# Altium schematic sheet bq78pl116.SchDoc
size A4; DocumentNumber: 2; SheetNumber: 2; SheetTotal: 4
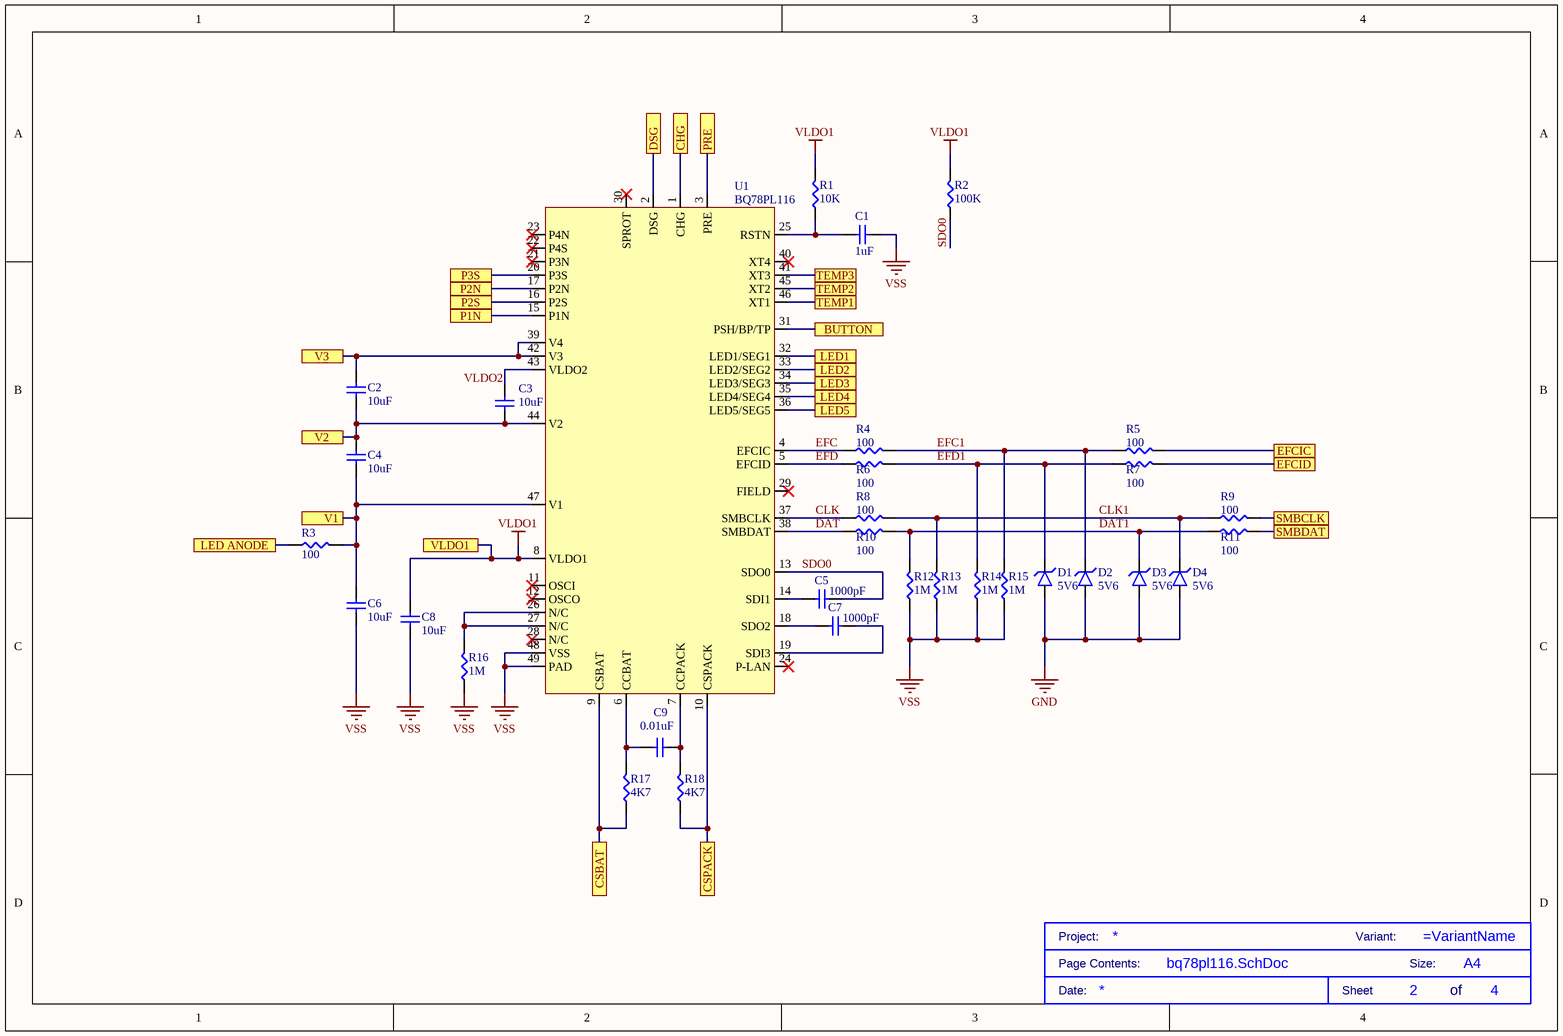
[diagram p0: bq78pl116.SchDoc]

## Parts
*  Size: A4  (hidden comment: TITLE BLOCK)  (graphical)
C1  1uF  [C0805]
C2  10uF  [C0805]
C3  10uF  [C0805]
C4  10uF  [C0805]
C5  1000pF  [C0805]
C6  10uF  [C0805]
C7  1000pF  [C0805]
C8  10uF  [C0805]
C9  0.01uF  [C0805]
D1  5V6  [MiniMELF]
D2  5V6  [MiniMELF]
D3  5V6  [MiniMELF]
D4  5V6  [MiniMELF]
R1  10K  [R0805]
R2  100K  [R0805]
R3  100  [R0805]
R4  100  [R0805]
R5  100  [R0805]
R6  100  [R0805]
R7  100  [R0805]
R8  100  [R0805]
R9  100  [R0805]
R10  100  [R0805]
R11  100  [R0805]
R12  1M  [R0805]
R13  1M  [R0805]
R14  1M  [R0805]
R15  1M  [R0805]
R16  1M  [R0805]
R17  4K7  [R0805]
R18  4K7  [R0805]
U1  BQ78PL116  [VQFN-48]

## Ports
BUTTON, CHG, CSBAT, CSPACK, DSG, EFCIC, EFCID, LED1, LED2, LED3, LED4, LED5, LED ANODE, P1N, P2N, P2S, P3S, PRE, SMBCLK, SMBDAT, TEMP1, TEMP2, TEMP3, V1, V2, V3, VLDO1

## Nets
GND: D1.1(A) D2.1(A) D3.1(A) D4.1(A)
VLDO1: C8.1 R1.2 R2.2 U1.8(VLDO1) ; port VLDO1
VSS: C1.2 C6.2 C8.2 R12.1 R13.1 R14.1 R15.1 R16.1 U1.48(VSS) U1.49(PAD)
BUTTON: U1.31(PSH/BP/TP) ; port BUTTON
CHG: U1.1(CHG) ; port CHG
CLK: R8.1 U1.37(SMBCLK)
CLK1: D4.2(K) R8.2 R9.1 R13.2
CSBAT: R17.1 U1.9(CSBAT) ; port CSBAT
CSPACK: R18.1 U1.10(CSPACK) ; port CSPACK
DAT: R10.1 U1.38(SMBDAT)
DAT1: D3.2(K) R10.2 R11.1 R12.2
DSG: U1.2(DSG) ; port DSG
EFC: R4.1 U1.4(EFCIC)
EFC1: D2.2(K) R4.2 R5.1 R15.2
EFCIC: R5.2 ; port EFCIC
EFCID: R7.2 ; port EFCID
EFD: R6.1 U1.5(EFCID)
EFD1: D1.2(K) R6.2 R7.1 R14.2
LED1: U1.32(LED1/SEG1) ; port LED1
LED2: U1.33(LED2/SEG2) ; port LED2
LED3: U1.34(LED3/SEG3) ; port LED3
LED4: U1.35(LED4/SEG4) ; port LED4
LED5: U1.36(LED5/SEG5) ; port LED5
LED ANODE: R3.2 ; port LED ANODE
P1N: U1.15(P1N) ; port P1N
P2N: U1.17(P2N) ; port P2N
P2S: U1.16(P2S) ; port P2S
P3S: U1.20(P3S) ; port P3S
PRE: U1.3(PRE) ; port PRE
SDO0: C5.2 R2.1 U1.13(SDO0)
SMBCLK: R9.2 ; port SMBCLK
SMBDAT: R11.2 ; port SMBDAT
TEMP1: U1.46(XT1) ; port TEMP1
TEMP2: U1.45(XT2) ; port TEMP2
TEMP3: U1.41(XT3) ; port TEMP3
V1: C4.2 C6.1 R3.1 U1.47(V1) ; port V1
V2: C2.2 C3.2 C4.1 U1.44(V2) ; port V2
V3: C2.1 U1.39(V4) U1.42(V3) ; port V3
VLDO2: C3.1 U1.43(VLDO2)
NetC1_1: C1.1 R1.1 U1.25(RSTN)
NetC5_1: C5.1 U1.14(SDI1)
NetC7_1: C7.1 U1.18(SDO2)
NetC7_2: C7.2 U1.19(SDI3)
NetC9_1: C9.1 R17.2 U1.6(CCBAT)
NetC9_2: C9.2 R18.2 U1.7(CCPACK)
NetR16_2: R16.2 U1.26(N/C) U1.27(N/C)

Not connected (* = marked no-connect by the designer): U1 11(OSCI)* 12(OSCO)* 21(P3N)* 22(P4S)* 23(P4N)* 24(P-LAN)* 28(N/C)* 29(FIELD)* 30(SPROT)* 40(XT4)*

## Notes on the sheet
- (in symbol TITLE BLOCK) Project:; Variant:; Page Contents:; Size:; Date:; Sheet; of

## Library data of the parts
C1 = CAP 0805 1uF: 0805 C 1uF Ceramic Multilayer Capacitor; 50 V; +125degC; X7R Dielectric; +/-10%; Manufacturer: KEMET; Manufacturer Part Number: C0805C105K5RACTU; Tolerance: 10%; Voltage Rating: 50V; Supplier 1: Arrow Electronics; RoHS: Yes; Category: Ceramic Capacitors; Stock 1: 317103; Pricing 1: 2500=0,25080, 10000=0,22150 (USD); Mount: Surface Mount,PCB; Case/Package: 0805; Case Code (Metric): 2012; Case Code (Imperial): 0805; Contact Plating: Tin,Matte; Dielectric Material: Ceramic; Min Operating Temperature: -55°C; Max Operating Temperature: 125°C; Packaging: Tape and Reel; Capacitance: 1uF; Voltage Rating (DC): 50V; Package Quantity: 1; Dielectric: X7R; Termination: SMD/SMT; Voltage: 50V; Series: C; Construction: Flat; Length: 2mm; Width: 0.049inch; Height: 1.25mm; Thickness: 0.055inch; Depth: 1.25mm; REACH SVHC: No SVHC; RoHS Compliant: Yes; ComponentLink1URL: https://datasheet.ciiva.com/7842/1732744-7842192.pdf?src-supplier=Element14; ComponentLink1Description: https://datasheet.ciiva.com/7842/1732744-7842192.pdf?src-supplier=Element14; ComponentLink2URL: https://datasheet.ciiva.com/5408/kem-c1002-x7r-smd-5408569.pdf?src-supplier=Mouser; ComponentLink2Description: https://datasheet.ciiva.com/5408/kem-c1002-x7r-smd-5408569.pdf?src-supplier=Mouser; ComponentLink3URL: https://datasheet.ciiva.com/22700/1851736-22700523.pdf?src-supplier=Element14; ComponentLink3Description: https://datasheet.ciiva.com/22700/1851736-22700523.pdf?src-supplier=Element14; Supplier Part Number 1: C0805C105K5RACTU
C2-C4 C6 C8 = CAP 0805 10uF: Cap Ceramic 10uF 10V X5R 10% SMD 0805 85C Plastic T/R; Manufacturer: KEMET; Manufacturer Part Number: C0805L106K8PACTU; Supplier 1: Mouser; RoHS: Yes; Category: Ceramic Capacitors; Stock 1: 15642; Pricing 1: 1=0,73000, 10=0,54000, 50=0,54000, 100=0,37000, 1000=0,24700, 10000=0,21500 (USD); Mount: Surface Mount; Case/Package: 0805; Case Code (Metric): 2012; Case Code (Imperial): 0805; Min Operating Temperature: -55°C; Max Operating Temperature: 85°C; Package Quantity: 4000; Capacitance: 10uF; Voltage Rating: 10V; Tolerance: 10%; Packaging: Tape and Reel; Dielectric: X5R; Termination: SMD/SMT; Voltage Rating (DC): 10V; Series: C; Length: 0.079inch; Width: 0.049inch; Thickness: 0.037inch; Depth: 1.25mm; REACH SVHC: No SVHC; RoHS Compliant: Yes; ComponentLink1URL: https://datasheet.ciiva.com/23928/1751297-23928886.pdf?src-supplier=Newark; ComponentLink1Description: https://datasheet.ciiva.com/23928/1751297-23928886.pdf?src-supplier=Newark; ComponentLink2URL: https://datasheet.ciiva.com/232/mlcclowprofile-232272.pdf?src-supplier=Digi-Key; ComponentLink2Description: https://datasheet.ciiva.com/232/mlcclowprofile-232272.pdf?src-supplier=Digi-Key; ComponentLink3URL: https://datasheet.ciiva.com/193/mlcclowprofile-193796.pdf?src-supplier=Digi-Key; ComponentLink3Description: https://datasheet.ciiva.com/193/mlcclowprofile-193796.pdf?src-supplier=Digi-Key; ComponentLink4URL: https://datasheet.ciiva.com/232/mlcclowprofile-232271.pdf?src-supplier=Digi-Key; ComponentLink4Description: https://datasheet.ciiva.com/232/mlcclowprofile-232271.pdf?src-supplier=Digi-Key; Supplier Part Number 1: 80-C0805L106K8P
C5 C7 = CAP 0805 1000pF: Cap Ceramic 0.001uF 50V X7R 10% SMD 0805 125C Plastic T/R; Manufacturer: KEMET; Manufacturer Part Number: C0805C102K5RACTU; Capacitance: 1nF; Supplier 1: Arrow Electronics; RoHS: Yes; Category: Ceramic Capacitors; Stock 1: 255800; Pricing 1: 4000=0,03830 (USD); Mount: Surface Mount,PCB; Case/Package: 0805; Number of Pins: 2; Dielectric Material: Ceramic; Case Code (Imperial): 0805; Case Code (Metric): 2012; Contact Plating: Tin,Matte; Min Operating Temperature: -55°C; Max Operating Temperature: 125°C; Tolerance: 10%; Packaging: Tape and Reel; Dielectric: X7R; Voltage Rating (DC): 50V; Voltage Rating: 50V; Series: SMD Comm X7R; Package Quantity: 4000; Termination: SMD/SMT; Construction: Flat; Voltage: 50V; Length: 2mm; Width: 1.25mm; Height: 0.78mm; Depth: 1.25mm; Lead Pitch: 0.75mm; Radiation Hardening: No; RoHS Compliant: Yes; REACH SVHC: No SVHC; ComponentLink1URL: https://datasheet.ciiva.com/7842/1918693-7842527.pdf?src-supplier=Element14; ComponentLink1Description: https://datasheet.ciiva.com/7842/1918693-7842527.pdf?src-supplier=Element14; ComponentLink2URL: https://datasheet.ciiva.com/18193/getdatasheetpartid-385640-18193338.pdf?src-supplier=Verical; ComponentLink2Description: https://datasheet.ciiva.com/18193/getdatasheetpartid-385640-18193338.pdf?src-supplier=Verical; ComponentLink3URL: https://datasheet.ciiva.com/39122/docfinderpartnumberc0402c102k5ractu-39122922.pdf?src-supplier=Onlinecomponents.com; ComponentLink3Description: https://datasheet.ciiva.com/39122/docfinderpartnumberc0402c102k5ractu-39122922.pdf?src-supplier=Onlinecomponents.com; Supplier Part Number 1: C0805C102K5RACTU
C9 = CAP 0805 0.01uF: Cap Ceramic 0.01uF 16V X7R 10% SMD 0805 125°C Paper T/R; Manufacturer: KEMET; Manufacturer Part Number: C0805C103K4RACTU; Capacitance: 10nF; Supplier 1: Arrow Electronics; RoHS: Yes; Category: Ceramic Capacitors; Stock 1: 24000; Pricing 1: 4000=0,07000, 8000=0,06640, 12000=0,06580, 20000=0,06310, 24000=0,05650, 100000=0,04830 (USD); Mount: Surface Mount; Case/Package: 0805; Case Code (Metric): 2012; Case Code (Imperial): 0805; Dielectric Material: Ceramic; Min Operating Temperature: -55°C; Max Operating Temperature: 125°C; Package Quantity: 1; Voltage Rating: 16V; Tolerance: 10%; Packaging: Tape and Reel; Voltage Rating (DC): 16V; Dielectric: X7R; Termination: SMD/SMT; Length: 2mm; Width: 0.049inch; Height: 0.78mm; Thickness: 0.035inch; Lead Pitch: 0.75mm; Depth: 1.25mm; Radiation Hardening: No; REACH SVHC: No SVHC; ComponentLink1URL: http://www.farnell.com/datasheets/2746090.pdf?src-supplier=Farnell; ComponentLink1Description: http://www.farnell.com/datasheets/2746090.pdf?src-supplier=Farnell; ComponentLink2URL: http://www.mouser.com/ds/2/212/KEM_C1002_X7R_SMD-1102033.pdf?src-supplier=Mouser; ComponentLink2Description: http://www.mouser.com/ds/2/212/KEM_C1002_X7R_SMD-1102033.pdf?src-supplier=Mouser; ComponentLink3URL: https://api.kemet.com/component-edge/download/datasheet/C0805C103K4RACTU.pdf?src-supplier=Digi-Key; ComponentLink3Description: https://api.kemet.com/component-edge/download/datasheet/C0805C103K4RACTU.pdf?src-supplier=Digi-Key; ComponentLink4URL: http://www.farnell.com/datasheets/1791936.pdf?src-supplier=Newark; ComponentLink4Description: http://www.farnell.com/datasheets/1791936.pdf?src-supplier=Newark; ComponentLink5URL: http://www.farnell.com/datasheets/2746090.pdf?src-supplier=Newark; ComponentLink5Description: http://www.farnell.com/datasheets/2746090.pdf?src-supplier=Newark; ComponentLink6URL: http://www.farnell.com/datasheets/2064983.pdf?src-supplier=Element14; ComponentLink6Description: http://www.farnell.com/datasheets/2064983.pdf?src-supplier=Element14; ComponentLink7URL: http://components.arrow.com/part/dataview/3450723S5469568N7429?src-supplier=Arrow+Electronics; ComponentLink7Description: http://components.arrow.com/part/dataview/3450723S5469568N7429?src-supplier=Arrow+Electronics; Supplier Part Number 1: C0805C103K4RACTU
D1-D4 = ZENER 5V6: Diode Zener Single 5.6V 7% 500mW Automotive 2-Pin Mini-MELF T/R; Manufacturer: Diotec; Manufacturer Part Number: ZMM5.6; Tolerance: 5%; Supplier 1: Arrow Electronics; RoHS: Yes; Category: Zener Diodes; Stock 1: 11; Pricing 1: 1=0,10930, 10=0,02530 (USD); Case/Package: SOD; Zener Voltage: 5.6V; Power Dissipation: 500mW; RoHS Compliant: Yes; ComponentLink1URL: https://datasheet.ciiva.com/26309/rvzmm1-zmm75-data-e-26309545.pdf?src-supplier=Distrelec; ComponentLink1Description: https://datasheet.ciiva.com/26309/rvzmm1-zmm75-data-e-26309545.pdf?src-supplier=Distrelec; Supplier Part Number 1: ZMM5.6
R1 = RES 0805 10K: Res Thick Film 0805 10K Ohm 5% 1/8W ±200ppm/°C Molded SMD Paper T/R; Manufacturer: Vishay Semiconductors; Manufacturer Part Number: CRCW080510K0JNEAC; Power Rating: 125mW; Resistance: 10kR; Supplier 1: Digi-Key; RoHS: Yes; Category: Resistors; Stock 1: 53351; Pricing 1: 1=0,10000, 10=0,03500, 100=0,01420, 1000=0,00636, 2500=0,00552 (USD); Mount: Surface Mount; Case/Package: SMD/SMT; Contact Plating: Tin; Min Operating Temperature: -55°C; Max Operating Temperature: 155°C; Resistor Type: Thick Film; Termination: Wraparound; Tolerance: 5%; Temperature Coefficient: 200ppm/°C; Length: 2mm; Lead Free: Lead Free; ComponentLink1URL: http://www.vishay.com/docs/20035/dcrcwe3.pdf?src-supplier=Avnet+Asia; ComponentLink1Description: http://www.vishay.com/docs/20035/dcrcwe3.pdf?src-supplier=Avnet+Asia; ComponentLink2URL: http://www.vishay.com/docs/28773/crcwce3.pdf?src-supplier=Digi-Key; ComponentLink2Description: http://www.vishay.com/docs/28773/crcwce3.pdf?src-supplier=Digi-Key; Supplier Part Number 1: 541-4163-1-ND
R2 = RES 0805 100K: RES SMD 100K OHM 5% 1/8W 0805; Manufacturer: Vishay; Manufacturer Part Number: CRCW0805100KJNEAC; Resistance: 100kR; Max Power Dissipation: 125mW; Temperature Coefficient: 200ppm/°C; Supplier 1: Digi-Key; RoHS: No; Category: Chip SMD Resistors; Stock 1: 93530; Pricing 1: 1=0,10000, 10=0,03500, 100=0,01420, 1000=0,00636, 2500=0,00552 (USD); Case/Package: 0805; Case Code (Imperial): 0805; Case Code (Metric): 2012; Min Operating Temperature: -55°C; Max Operating Temperature: 155°C; Resistor Type: Thick Film; Packaging: Tape and Reel; Tolerance: 5%; Number of Terminations: 2; ComponentLink1URL: http://www.vishay.com/docs/28773/crcwce3.pdf?src-supplier=Digi-Key; ComponentLink1Description: http://www.vishay.com/docs/28773/crcwce3.pdf?src-supplier=Digi-Key; Supplier Part Number 1: 541-4164-1-ND
R3-R11 = RES 0805 100: Res Thick Film 0805 100 Ohm 5% 1/8W ±200ppm/°C Molded SMD Paper T/R; Manufacturer: Vishay Semiconductors; Manufacturer Part Number: CRCW0805100RJNEAC; Power Rating: 125mW; Resistance: 100R; Supplier 1: Digi-Key; RoHS: No; Category: Chip SMD Resistors; Stock 1: 69770; Pricing 1: 1=0,10000, 10=0,03500, 100=0,01420, 1000=0,00636, 2500=0,00552 (USD); Case/Package: 0805; Tolerance: 5%; Lead Free: Lead Free; ComponentLink1URL: http://www.vishay.com/docs/28773/crcwce3.pdf?src-supplier=Digi-Key; ComponentLink1Description: http://www.vishay.com/docs/28773/crcwce3.pdf?src-supplier=Digi-Key; Supplier Part Number 1: 541-4166-1-ND
R12-R16 = RES 0805 1M: Res Thick Film 0805 1M Ohm 5% 0.125W(1/8W) ±200ppm/°C Pad SMD T/R; Manufacturer: Vishay; Manufacturer Part Number: CRCW08051M00JNEAC; Supplier 1: Mouser; RoHS: No; Category: Chip SMD Resistors; Stock 1: 183; Pricing 1: 1=0,10000, 10=0,04000, 50=0,04000, 100=0,01700, 250=0,01600, 500=0,01500, 1000=0,00800, 2500=0,00700, 5000=0,00500, 10000=0,00500 (USD); Supplier Part Number 1: 71-CRCW08051M00JNEAC
R17 R18 = RES 0805 4K7: Res Thick Film 0805 4.7K Ohm 5% 1/8W ±200ppm/°C Molded SMD Paper T/R; Manufacturer: Vishay; Manufacturer Part Number: CRCW08054K70JNEAC; Power Rating: 125mW; Resistance: 4.7kR; Supplier 1: Digi-Key; Category: Resistors; Stock 1: 76524; Pricing 1: 1=0,10000, 10=0,03500, 100=0,01420, 1000=0,00636, 2500=0,00552 (USD); Case/Package: 0805; Tolerance: 5%; Lead Free: Lead Free; ComponentLink1URL: http://www.vishay.com/docs/28773/crcwce3.pdf?src-supplier=Digi-Key; ComponentLink1Description: http://www.vishay.com/docs/28773/crcwce3.pdf?src-supplier=Digi-Key; ComponentLink2URL: http://datasheet.octopart.com/CRCW08054K70JNEAC-Vishay-datasheet-100063072.pdf?src-supplier=Future+Electronics; ComponentLink2Description: http://datasheet.octopart.com/CRCW08054K70JNEAC-Vishay-datasheet-100063072.pdf?src-supplier=Future+Electronics; Supplier Part Number 1: 541-4165-1-ND
U1 = BQ78PL116RGZT: PowerLAN Master gateway controller with PowerPump cell Balancing technology 48-VQFN -40 to 85; Manufacturer: Texas Instruments; Operating Supply Voltage: 3.6V; Min Supply Voltage: 2.5V; Max Supply Voltage: 4.5V; Output Voltage: 400mV; Interface: SMBus; Supplier 1: Arrow Electronics; Manufacturer Part Number: BQ78PL116RGZT; RoHS: Yes; Category: Battery Management; Stock 1: 58; Pricing 1: 1=18,11000, 10=17,30000, 25=16,85000 (USD); Mount: Surface Mount; Case/Package: VQFN; Number of Pins: 48; Weight: 0.004938oz; Contact Plating: Gold; Min Operating Temperature: -40°C; Max Operating Temperature: 85°C; Packaging: Tape and Reel; Package Quantity: 1; Series: PowerLAN™, PowerPump™; Radiation Hardening: No; REACH SVHC: No SVHC; Lead Free: Lead Free; RoHS Compliant: Yes; ComponentLink1URL: https://datasheet.ciiva.com/4873/slusab8b-128725-4873339.pdf?src-supplier=Mouser; ComponentLink1Description: https://datasheet.ciiva.com/4873/slusab8b-128725-4873339.pdf?src-supplier=Mouser; ComponentLink2URL: https://datasheet.ciiva.com/15115/getdatasheetpartid-551675-15115367.pdf?src-supplier=Verical; ComponentLink2Description: https://datasheet.ciiva.com/15115/getdatasheetpartid-551675-15115367.pdf?src-supplier=Verical; ComponentLink3URL: https://datasheet.ciiva.com/3213/bq78pl116-3213329.pdf?src-supplier=Avnet; ComponentLink3Description: https://datasheet.ciiva.com/3213/bq78pl116-3213329.pdf?src-supplier=Avnet; ComponentLink4URL: https://datasheet.ciiva.com/1932/bq78pl116-1932797.pdf?src-supplier=Digi-Key; ComponentLink4Description: https://datasheet.ciiva.com/1932/bq78pl116-1932797.pdf?src-supplier=Digi-Key; ComponentLink5URL: https://datasheet.ciiva.com/1932/bq78pl116-1932796.pdf?src-supplier=Digi-Key; ComponentLink5Description: https://datasheet.ciiva.com/1932/bq78pl116-1932796.pdf?src-supplier=Digi-Key; ComponentLink6URL: https://datasheet.ciiva.com/1932/bq78pl116-1932798.pdf?src-supplier=Digi-Key; ComponentLink6Description: https://datasheet.ciiva.com/1932/bq78pl116-1932798.pdf?src-supplier=Digi-Key; Supplier Part Number 1: BQ78PL116RGZT